# EAGLE design driver motor (EAGLE 7.1.0)
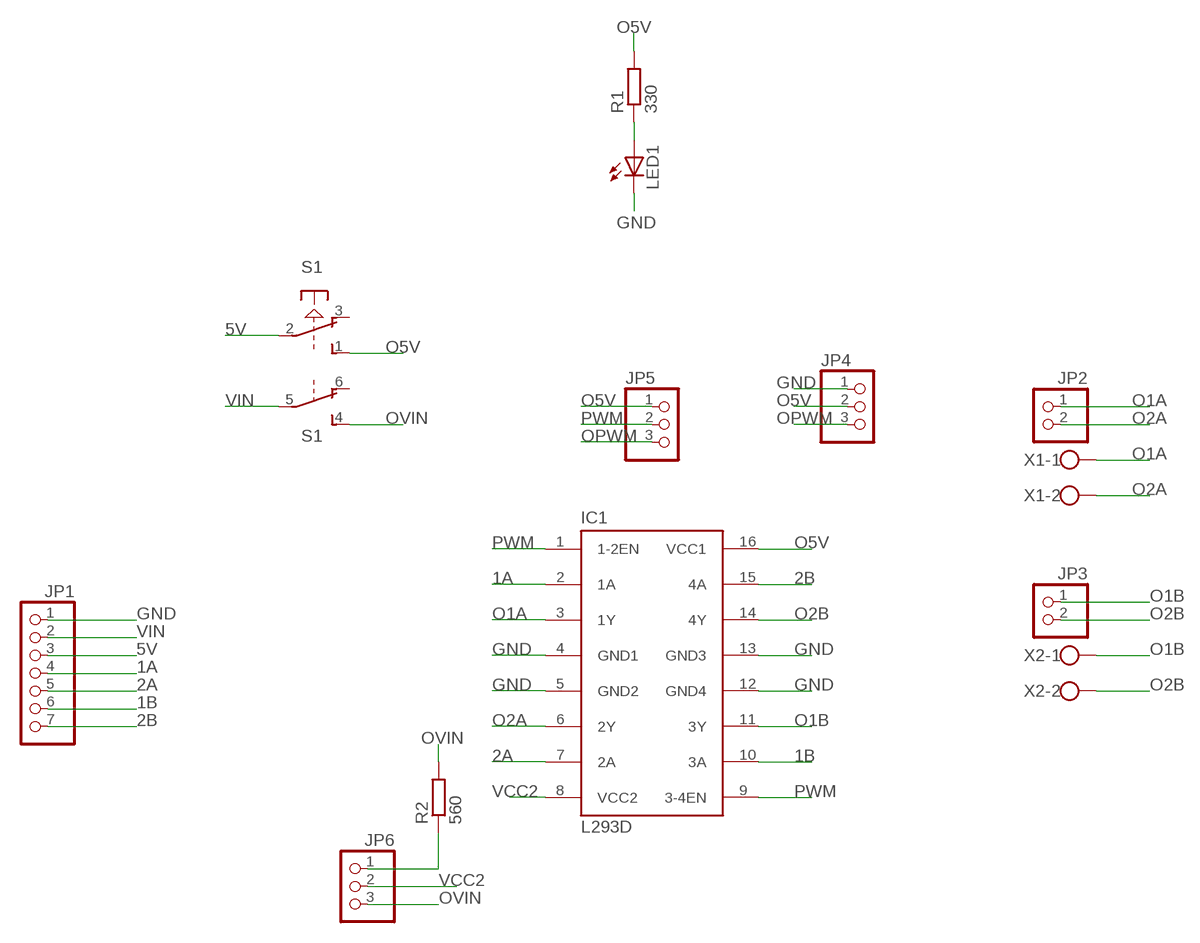
[diagram p0: schematic, sheet 1]

## Parts
IC1  L293D  [DIL16]
JP1  PINHD-1X7  [1X07]
JP2  PINHD-1X2  [1X02]
JP3  PINHD-1X2  [1X02]
JP4  PINHD-1X3  [1X03]
JP5  PINHD-1X3  [1X03]
JP6  PINHD-1X3  [1X03]
LED1  LED3MM  [LED3MM]
R1  330  R-EU_0207/7  [0207/7]
R2  560  R-EU_0207/7  [0207/7]
S1  PVA2R  [PVA2R]
X1  W237-102  [W237-102]
X2  W237-102  [W237-102]

## Nets
1A: IC1.2(1A) JP1.4
1B: IC1.10(3A) JP1.6
2A: IC1.7(2A) JP1.5
2B: IC1.15(4A) JP1.7
5V: JP1.3 S1.2(1:P)
GND: IC1.4(GND1) IC1.5(GND2) IC1.12(GND4) IC1.13(GND3) JP1.1 JP4.1 LED1.K(C)
N$1: LED1.A R1.1
N$2: JP6.1 R2.1
O1A: IC1.3(1Y) JP2.1 X1.1
O1B: IC1.11(3Y) JP3.1 X2.1
O2A: IC1.6(2Y) JP2.2 X1.2
O2B: IC1.14(4Y) JP3.2 X2.2
O5V: IC1.16(VCC1) JP4.2 JP5.1 R1.2 S1.1(1:S)
OPWM: JP4.3 JP5.3
OVIN: JP6.3 R2.2 S1.4(2:S)
PWM: IC1.1(1-2EN) IC1.9(3-4EN) JP5.2
VCC2: IC1.8(VCC2) JP6.2
VIN: JP1.2 S1.5(2:P)
Unconnected: S1.3(1:O) S1.6(2:O)

## Library data of the parts
IC1 = st-microelectronics:L293D: PUSH-PULL 4 CHANNEL DRIVER; MPN: L293D; OC_FARNELL: 9589619; OC_NEWARK: 56P8249
JP1 = pinhead:PINHD-1X7: PIN HEADER
JP2 JP3 = pinhead:PINHD-1X2: PIN HEADER
JP4-JP6 = pinhead:PINHD-1X3: PIN HEADER
LED1 = led:LED: LED OSRAM: - CHIPLED LG R971, LG N971, LY N971, LG Q971, LY Q971, LO R971, LY R971 LH N974, LH R974 LS Q976, LO Q976, LY Q976 LO Q996 - Hyper CHIPLED LW Q18S LB Q993, LB Q99A, LB R99A - SideLED LS A670, LO A670, LY A670, LG A670, LP A670 LB A673, LV A673, LT A673, LW A673 LH A674 LY A675 LS A676, LA A676, LO A676, LY A676, LW A676 LS A679, LY A679, LG A679 - Hyper Micro SIDELED® LS Y876, LA Y876, LO Y876, LY Y876 LT Y87S - SmartLED LW L88C, LW L88S LB L89C, LB L89S, LG L890 LS L89K, LO L89K, LY L89K LS L896, LA L896, LO L896, LY L896 - TOPLED LS T670, LO T670, LY T670, LG T670, LP T670 LSG T670, LSP T670, LSY T670, LOP T670, LYG T670 LG T671, LOG T671, LSG T671 LB T673, LV T673, LT T673, LW T673 LH T674 LS T676, LA T676, LO T676, LY T676, LB T676, LH T676, LSB T676, LW T676 LB T67C, LV T67C, LT T67C, LS T67K, LO T67K, LY T67K, LW E67C LS E67B, LA E67B, LO E67B, LY E67B, LB E67C, LV E67C, LT E67C LW T67C LS T679, LY T679, LG T679 LS T770, LO T770, LY T770, LG T770, LP T770 LB T773, LV T773, LT T773, LW T773 LH T774 LS E675, LA E675, LY E675, LS T675 LS T776, LA T776, LO T776, LY T776, LB T776 LHGB T686 LT T68C, LB T68C - Hyper Mini TOPLED® LB M676 - Mini TOPLED Santana® LG M470 LS M47K, LO M47K, LY M47K Source: http://www.osram.convergy.de LUXEON: - LUMILED® LXK2-PW12-R00, LXK2-PW12-S00, LXK2-PW14-U00, LXK2-PW14-V00 LXK2-PM12-R00, LXK2-PM12-S00, LXK2-PM14-U00 LXK2-PE12-Q00, LXK2-PE12-R00, LXK2-PE12-S00, LXK2-PE14-T00, LXK2-PE14-U00 LXK2-PB12-K00, LXK2-PB12-L00, LXK2-PB12-M00, LXK2-PB14-N00, LXK2-PB14-P00, LXK2-PB14-Q00 LXK2-PR12-L00, LXK2-PR12-M00, LXK2-PR14-Q00, LXK2-PR14-R00 LXK2-PD12-Q00, LXK2-PD12-R00, LXK2-PD12-S00 LXK2-PH12-R00, LXK2-PH12-S00 LXK2-PL12-P00, LXK2-PL12-Q00, LXK2-PL12-R00 Source: www.luxeon.com KINGBRIGHT: KA-3528ASYC Source: www.kingbright.com
R1 R2 = rcl:R-EU_: RESISTOR, European symbol
S1 = switch-misc:PVA2R: ITT SWITCH
X1 X2 = con-wago-500:W237-102: WAGO SCREW CLAMP; MPN: 237-102; OC_FARNELL: unknown; OC_NEWARK: 70K9898

## Board
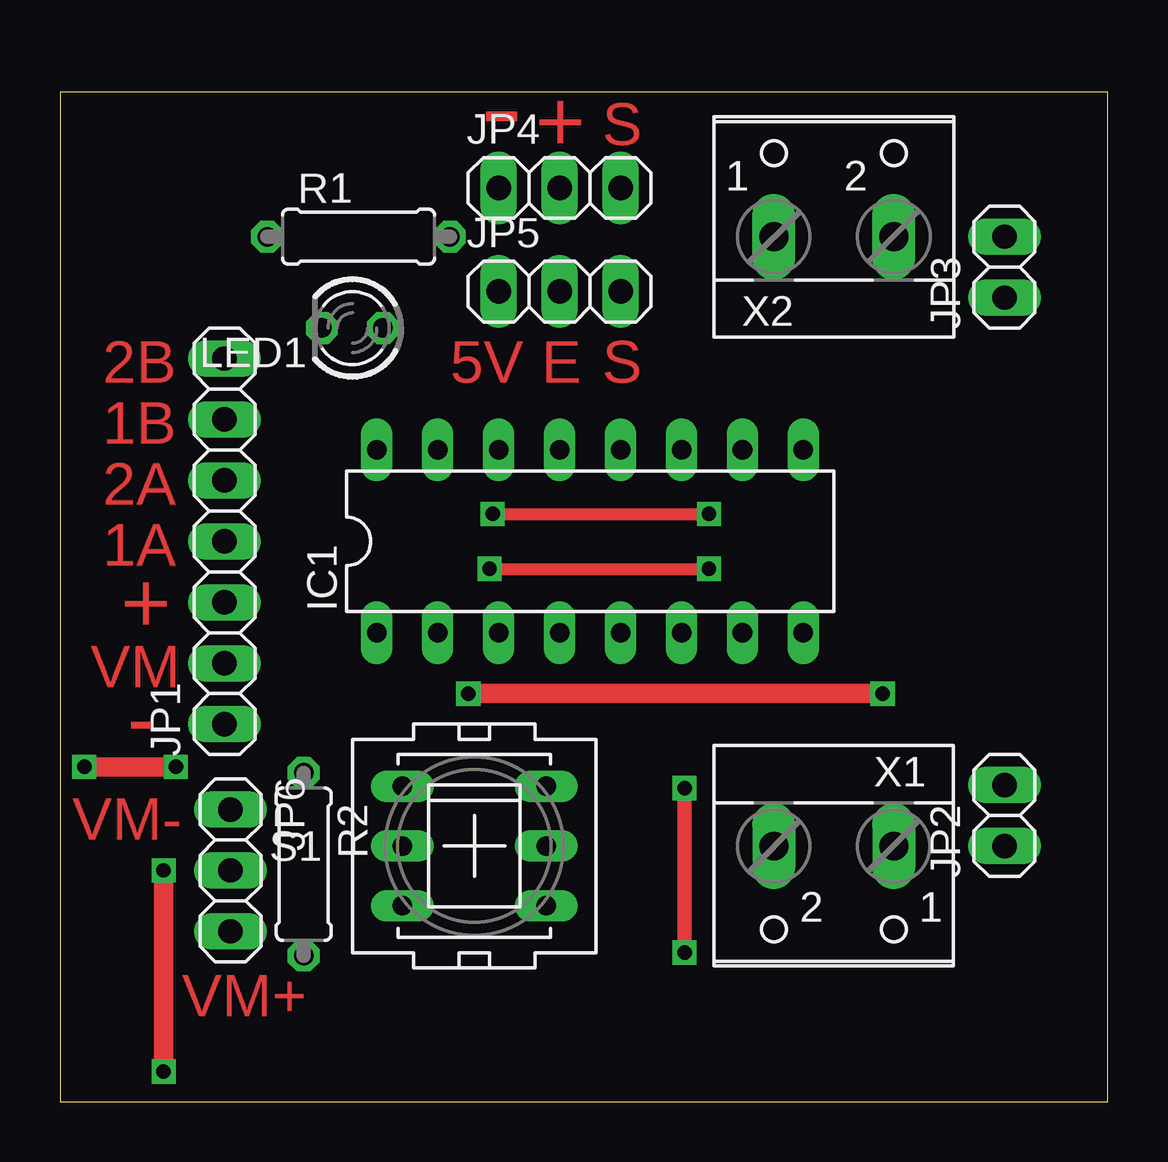
[diagram p1: board, top side]
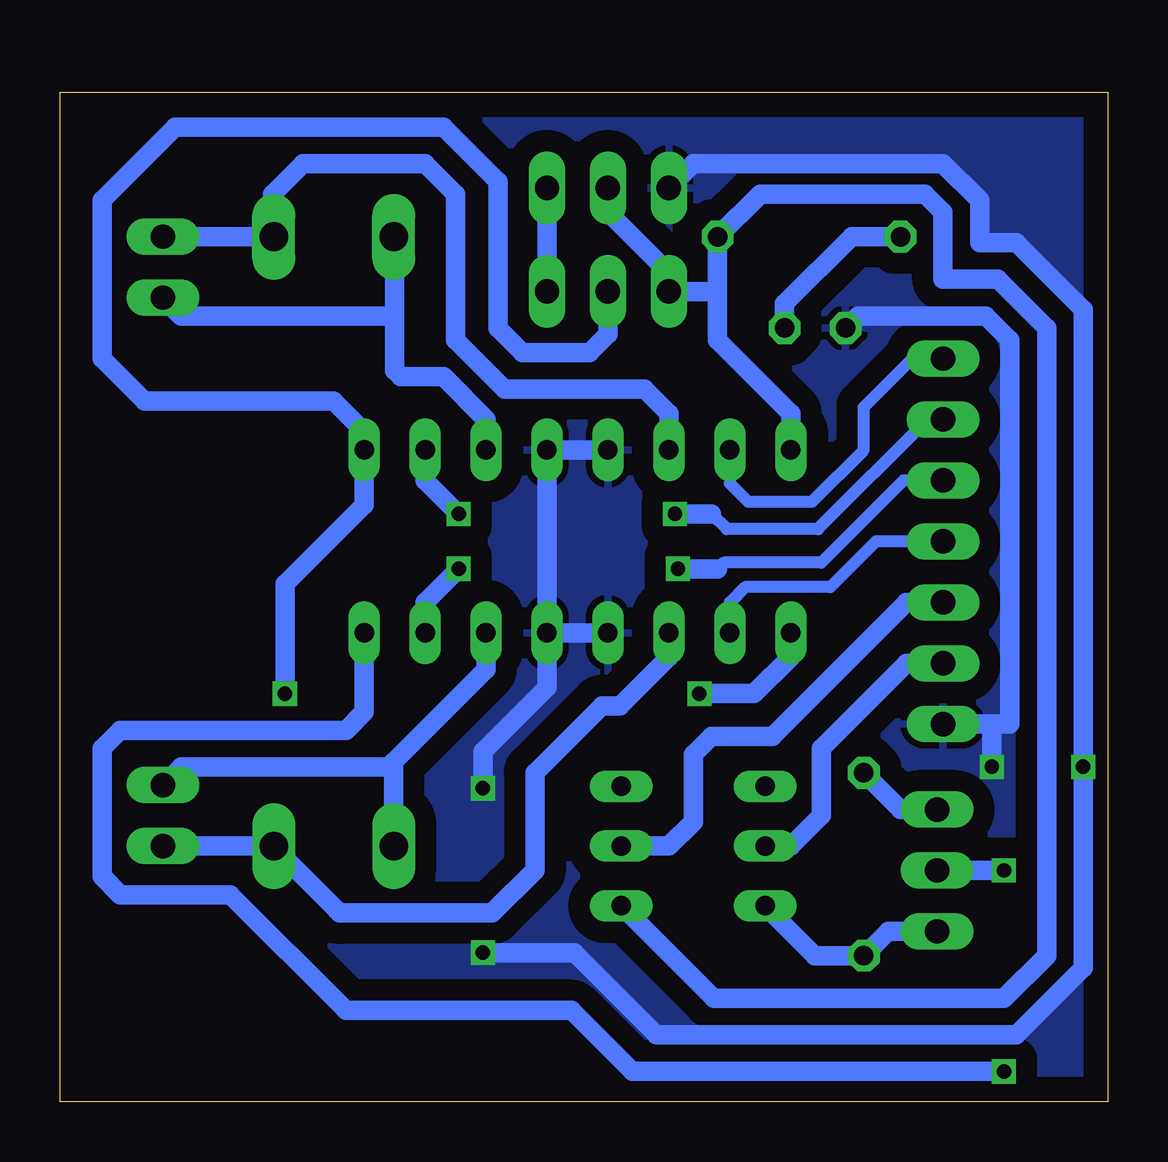
[diagram p2: board, bottom side, seen from below]

Size 43.67 x 42.09 mm. Coordinates in mm from the lower left corner, seen from the top.
Outline: 0,0 43.67,0 43.67,42.09 0,42.09 0,0
Copper layers (1*16): Top 0.035mm / dielectric 1.5mm / Bottom 0.035mm
Design rules "default *": minimum track width 10mil, minimum drill 24mil, track to track 35mil, track to pad 35mil, pad to pad 8mil, via to via 8mil, smd to smd 8mil, copper to edge 40mil, drill to drill 8mil, minimum pad ring 10mil, minimum via ring 8mil, stop-mask expansion 4mil, vias tented up to drill 0mil, thermal gap 10mil

### Footprints (pad centres in the part's own frame; a part is rotated, then mirrored left to right if it is on the bottom)
DIL16 = drill 0.813 long: 1 -8.89,-3.81; 2 -6.35,-3.81; 3 -3.81,-3.81; 4 -1.27,-3.81; 5 1.27,-3.81; 6 3.81,-3.81; 7 6.35,-3.81; 8 8.89,-3.81; 9 8.89,3.81; 10 6.35,3.81; 11 3.81,3.81; 12 1.27,3.81; 13 -1.27,3.81; 14 -3.81,3.81; 15 -6.35,3.81; 16 -8.89,3.81
1X07 = drill 1.016 long: 1 -7.62,0; 2 -5.08,0; 3 -2.54,0; 4 0,0; 5 2.54,0; 6 5.08,0; 7 7.62,0
1X02 = drill 1.016 long: 1 -1.27,0; 2 1.27,0
1X03 = drill 1.016 long: 1 -2.54,0; 2 0,0; 3 2.54,0
LED3MM = drill 0.813 octagon: A -1.27,0; K 1.27,0
0207/7 = drill 0.813 octagon: 1 -3.81,0; 2 3.81,0
PVA2R = drill 0.813 long: 1 -2.997,2.489; 2 -2.997,0; 3 -2.997,-2.489; 4 2.997,2.489; 5 2.997,0; 6 2.997,-2.489
W237-102 = drill 1.194 long: 1 -2.5,-1.27; 2 2.5,-1.27

### Placement (x,y rotation side)
IC1  22.1,23.37 0 top
JP1  6.86,23.37 90 top
JP2  39.37,11.94 90 top
JP3  39.37,34.8 90 top
JP4  20.83,38.1 0 top
JP5  20.83,33.78 0 top
JP6  7.11,9.65 270 top
LED1  12.19,32.26 180 top
R1  12.45,36.07 0 top
R2  10.16,9.91 270 top
S1  17.27,10.67 180 top
X1  32.26,9.4 180 top
X2  32.26,37.34 0 top

### Tracks (layer width: path | path; a pad name or v marks a point on that pad's centre or on a via)
1A
  Bottom 0.508: JP1.4 9.65,23.37 11.56,21.46 15.11,21.46 15.75,20.83 IC1.2
1B  (via drill 0.6)
  Top 0.508: v18.03,24.51 v27.05,24.51
  Bottom 0.508: JP1.6 7.49,28.45 12.06,23.88 15.88,23.88 16.51,24.51
  Bottom 0.813: v18.03,24.51 16.51,24.51 | IC1.10 28.45,25.91 v27.05,24.51
2A  (via drill 0.6)
  Top 0.508: v17.91,22.23 v27.05,22.23
  Bottom 0.508: JP1.5 8.51,25.91 11.94,22.48 16,22.48 16.26,22.23
  Bottom 0.813: v17.91,22.23 16.26,22.23 | IC1.7 28.45,20.83 v27.05,22.23
2B
  Bottom 0.508: JP1.7 8.13,30.99 10.16,28.96 10.16,27.18 12.32,25.02 14.99,25.02 15.75,25.78 IC1.15
5V
  Bottom 0.813: JP1.3 8.38,20.83 13.97,15.24 16.51,15.24 17.27,14.48 17.27,11.68 18.29,10.67 S1.2
GND  (via drill 0.6)
  Top 0.61: v26.04,6.22 v26.04,13.08
  Top 0.813: v4.83,13.97 v1.02,13.97
  Bottom 0.813: IC1.4 IC1.5 | IC1.13 IC1.12 IC1.5 | v26.04,6.22 22.23,6.22 18.8,2.79 3.81,2.79 1.02,5.59 v1.02,13.97 1.02,33.02 3.81,35.81 5.33,35.81 5.33,37.59 6.86,39.12 17.27,39.12 JP4.1 | LED1.K 10.41,32.77 5.08,32.77 4.06,31.75 4.06,15.75 4.83,15.75 | v26.04,13.08 26.04,14.6 23.37,17.27 IC1.5 | JP1.1 4.83,15.75 | 4.83,15.75 v4.83,13.97
  pour Bottom: -0.25,42.16 43.69,42.16 43.69,0 0,0
N$1
  Bottom 0.813: R1.1 10.67,36.07 13.46,33.27 LED1.A
N$2
  Bottom 0.813: JP6.1 8.64,12.19 R2.1
O1A
  Bottom 0.813: JP2.1 X1.1 34.76,10.63 32.13,8 32,7.87 25.65,7.87 23.88,9.65 23.88,13.72 21.08,16.51 20.32,16.51 18.29,18.54 IC1.3
O1B
  Bottom 0.813: 29.72,32.51 29.72,30.48 29.46,30.23 27.69,30.23 25.91,28.45 IC1.11 | 29.72,32.51 29.72,36.03 X2.1 | JP3.1 38.61,32.77 29.97,32.77 29.72,32.51
O2A
  Bottom 0.813: IC1.6 25.91,18.03 29.76,14.18 29.76,13.72 | X1.2 29.76,13.72 | JP2.2 38.61,13.97 30.01,13.97 29.76,13.72
O2B
  Bottom 0.813: IC1.14 18.29,28.7 19.3,29.72 25.15,29.72 27.18,31.75 27.18,37.85 28.45,39.12 33.53,39.12 34.8,37.85 34.8,36.11 X2.2 JP3.2
O5V
  Bottom 0.813: JP4.2 20.83,37.08 18.29,34.54 JP5.1 16.51,33.78 16.26,33.53 | IC1.16 13.21,28.7 16.26,31.75 16.26,33.53 | 16.26,33.53 R1.2 14.48,37.85 7.62,37.85 6.86,37.08 6.86,34.29 4.57,34.29 2.54,32.26 2.54,6.1 4.32,4.32 16.41,4.32 S1.1
OPWM
  Bottom 0.813: JP4.3 JP5.3
OVIN
  Bottom 0.813: S1.4 12.19,6.1 R2.2 9.14,7.11 JP6.3
PWM  (via drill 0.6)
  Top 0.813: v17.02,17.02 v34.29,17.02
  Bottom 0.813: IC1.1 13.21,18.54 14.73,17.02 v17.02,17.02 | JP5.2 20.83,32 21.59,31.24 24.38,31.24 25.4,32.26 25.4,38.35 27.69,40.64 38.86,40.64 41.91,37.59 41.91,30.99 40.13,29.21 32.26,29.21 30.99,27.94 IC1.9 30.99,24.89 34.29,21.59 v34.29,17.02
VCC2  (via drill 0.6)
  Top 0.813: v4.32,9.65 v4.32,1.27
  Bottom 0.813: IC1.8 30.99,16.26 31.75,15.49 41.15,15.49 41.91,14.73 41.91,9.4 41.15,8.64 36.58,8.64 31.75,3.81 22.35,3.81 19.81,1.27 v4.32,1.27 | JP6.2 v4.32,9.65
VIN
  Bottom 0.813: JP1.2 8.38,18.29 11.94,14.73 11.94,11.94 13.21,10.67 S1.5

### Text on the board
Top: - | + | S | 2B | 5V | E | S | 1B | 2A | 1A | + | VM | - | - | VM- | VM+